# EAGLE design baxandall (EAGLE 7.5.0)
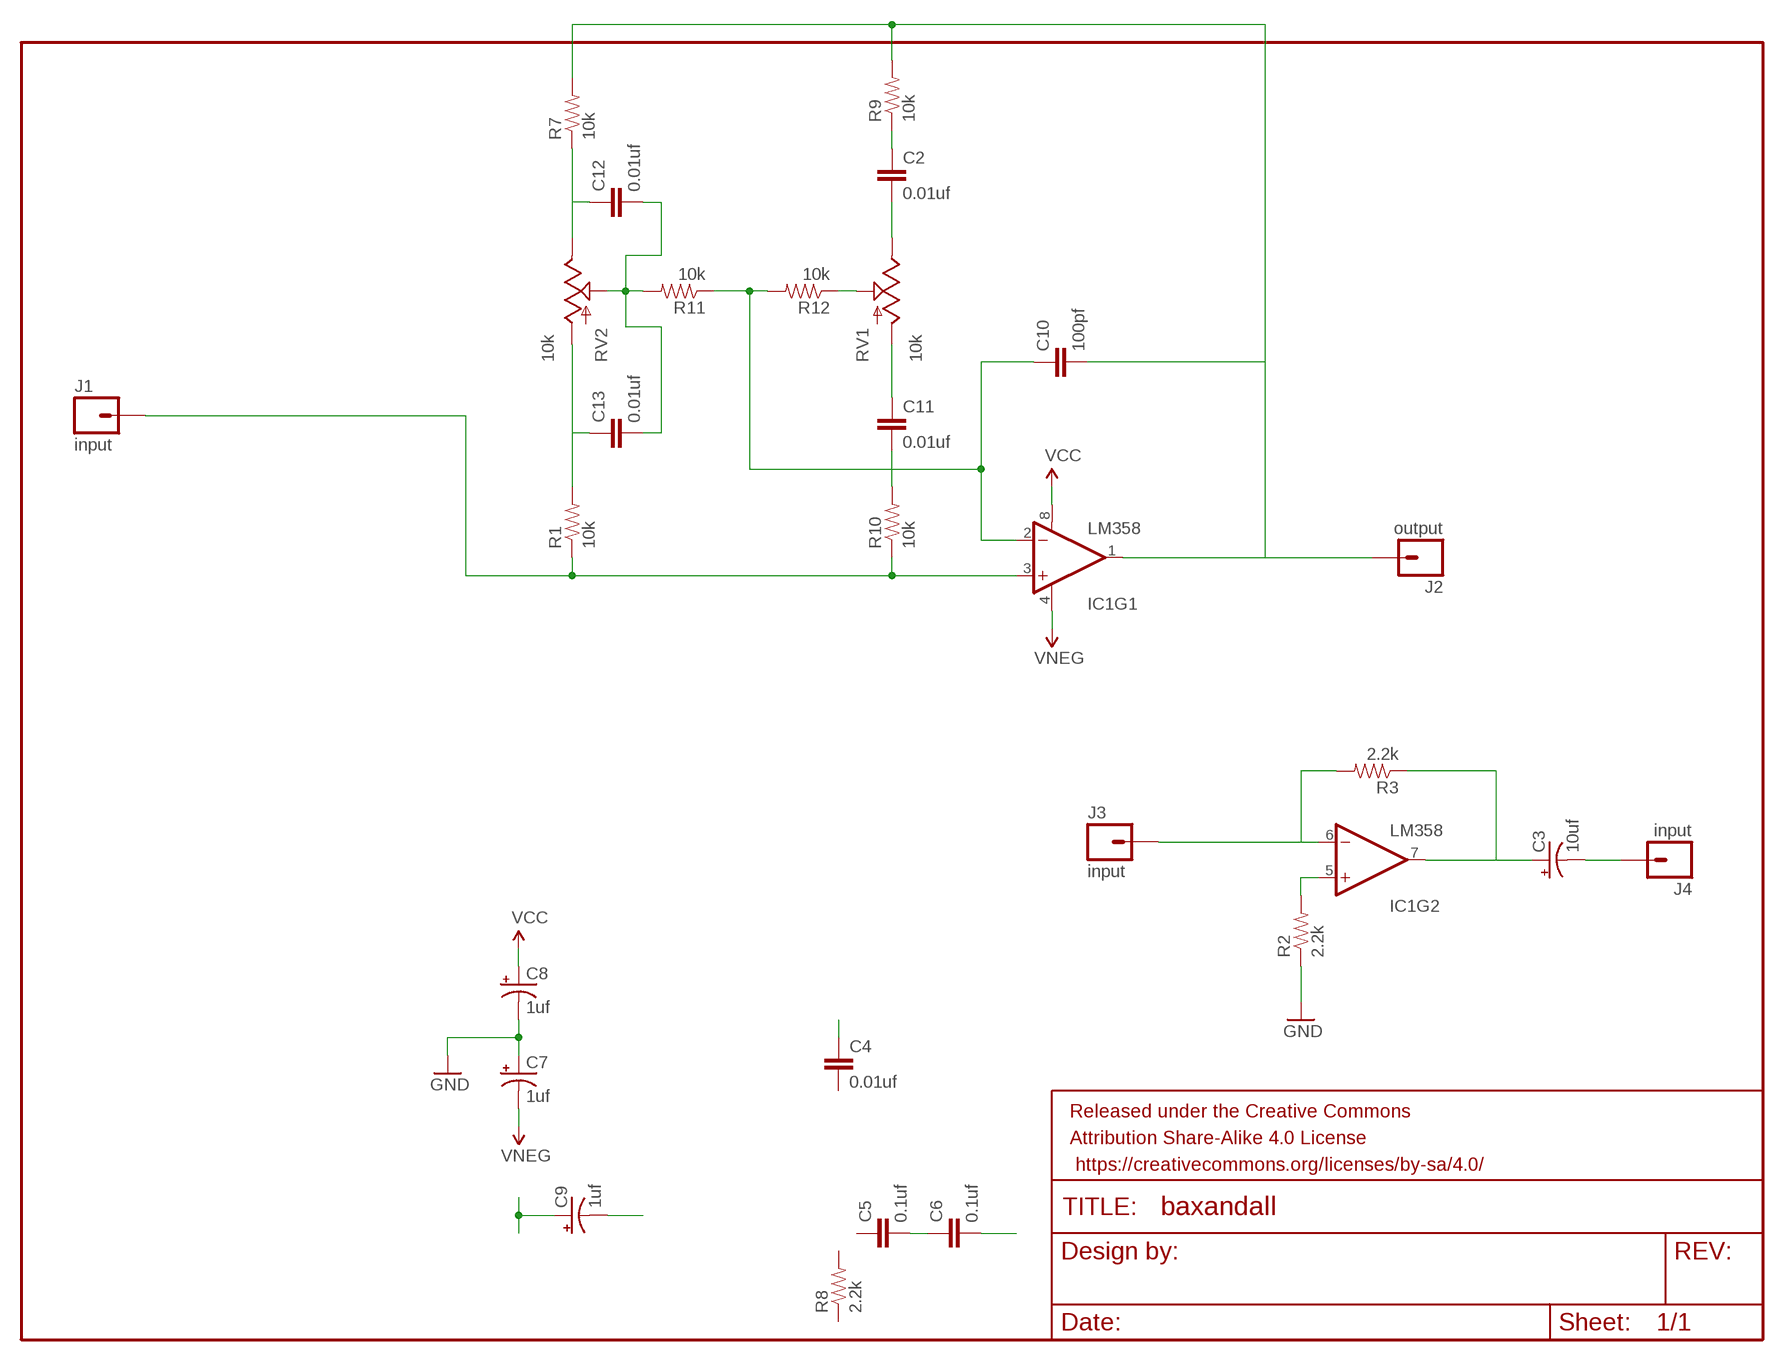
[diagram p0: schematic, sheet 1]

## Parts
C2  0.01uf  CAPPTH  [CAP-PTH-SMALL]
C3  10uf  10UF-25V-20%(PTH)  [CPOL-RADIAL-10UF-25V]
C4  0.01uf  CAPPTH  [CAP-PTH-SMALL]
C5  0.1uf  CAPPTH  [CAP-PTH-SMALL]
C6  0.1uf  CAPPTH  [CAP-PTH-SMALL]
C7  1uf  CAP_POLPTH2  [CPOL-RADIAL-10UF-25V]
C8  1uf  CAP_POLPTH2  [CPOL-RADIAL-10UF-25V]
C9  1uf  CAP_POLPTH2  [CPOL-RADIAL-10UF-25V]
C10  100pf  CAPPTH  [CAP-PTH-SMALL]
C11  0.01uf  CAPPTH  [CAP-PTH-SMALL]
C12  0.01uf  CAPPTH  [CAP-PTH-SMALL]
C13  0.01uf  CAPPTH  [CAP-PTH-SMALL]
FRAME1  FRAME-LETTER  [CREATIVE_COMMONS]
IC1  LM358  [DIP08]
J1  input  M01NOSILK-KIT  [1X01NS-KIT]
J2  output  M01NOSILK-KIT  [1X01NS-KIT]
J3  input  M01NOSILK-KIT  [1X01NS-KIT]
J4  input  M01NOSILK-KIT  [1X01NS-KIT]
R1  10k  10KOHM-1/4W-1%(PTH)HORIZ  [AXIAL-0.3]
R2  2.2k  RESISTORAXIAL-0.3  [AXIAL-0.3]
R3  2.2k  RESISTORAXIAL-0.3  [AXIAL-0.3]
R7  10k  10KOHM-1/4W-1%(PTH)HORIZ  [AXIAL-0.3]
R8  2.2k  RESISTORAXIAL-0.3  [AXIAL-0.3]
R9  10k  10KOHM-1/4W-1%(PTH)HORIZ  [AXIAL-0.3]
R10  10k  10KOHM-1/4W-1%(PTH)HORIZ  [AXIAL-0.3]
R11  10k  10KOHM-1/4W-1%(PTH)HORIZ  [AXIAL-0.3]
R12  10k  10KOHM-1/4W-1%(PTH)HORIZ  [AXIAL-0.3]
RV1  10k  POT-RV16AF-20  [POT_ALPHA_RV16AF-20]
RV2  10k  POT-RV16AF-20  [POT_ALPHA_RV16AF-20]

## Nets
GND: C7.1(+) C8.2(-) R2.P$1
N$1: C12.1 R7.P$1 RV2.3(E)
N$2: C13.1 R1.P$2 RV2.1(A)
N$3: C10.1 IC1.2(-IN) R11.P$1 R12.P$2
N$4: C11.2 R10.P$2
N$5: C10.2 IC1.1(OUT) J2.1 R7.P$2 R9.P$2
N$6: IC1.5(+IN) R2.P$2
N$7: C3.1(+) IC1.7(OUT) R3.P$1
N$8: R12.P$1 RV1.2(S)
N$9: IC1.3(+IN) J1.1 R1.P$1 R10.P$1
N$10: C11.1 RV1.1(A)
N$11: IC1.6(-IN) J3.1 R3.P$2
N$12: C3.2(-) J4.1
N$13: C9.1(+)
N$14: C12.2 C13.2 R11.P$2 RV2.2(S)
N$15: C2.2 RV1.3(E)
N$16: C9.2(-)
N$17: C4.1
N$18: C5.2 C6.1
N$19: C2.1 R9.P$1
N$20: C6.2
VCC: C8.1(+) IC1.8(V+)
VNEG: C7.2(-) IC1.4(V-)
Unconnected: C4.2 C5.1 R8.P$1 R8.P$2

## Library data of the parts
C2 C4-C6 C10-C13 = SparkFun-Capacitors:CAP: Capacitor Standard 0603 ceramic capacitor, and 0.1" leaded capacitor.
C3 = SparkFun-Capacitors:10UF-25V-20%(PTH): CAP-08440; PROD_ID: CAP-08440
C7-C9 = SparkFun-Capacitors:CAP_POL: Capacitor Polarized These are standard SMD and PTH capacitors. Normally 10uF, 47uF, and 100uF in electrolytic and tantalum varieties. Always verify the external diameter of the through hole cap, it varies with capacity, voltage, and manufacturer. The EIA devices should be standard.
FRAME1 = SparkFun-Aesthetics:FRAME-LETTER: Schematic Frame Standard 8.5x11 US Letter frame
IC1 = SparkFun-AnalogIC:LM358: Jellybean op-amp; PROD_ID: IC-09172
J1-J4 = SparkFun-Connectors:M01: Header 1 Standard 1-pin 0.1" header. Use with straight break away headers (SKU : PRT-00116), right angle break away headers (PRT-00553), swiss pins (PRT-00743), machine pins (PRT-00117), and female headers (PRT-00115). SMTSO-256-ET is a "flush mount" nut for a 4-40 screw. The older package used to be too tight, and did not allow it to sit properly thru the drill hit. The latest (0.165DIA) fits nice and snug.
R1 R7 R9-R12 = SparkFun-Resistors:10KOHM-1/4W-1%(PTH): RES-12183; PROD_ID: RES-12183
R2 R3 R8 = SparkFun-Resistors:RESISTOR: Resistor Basic schematic elements and footprints for 0603, 1206, and PTH resistors.
RV1 RV2 = SparkFun-Electromechanical:POT

## Board
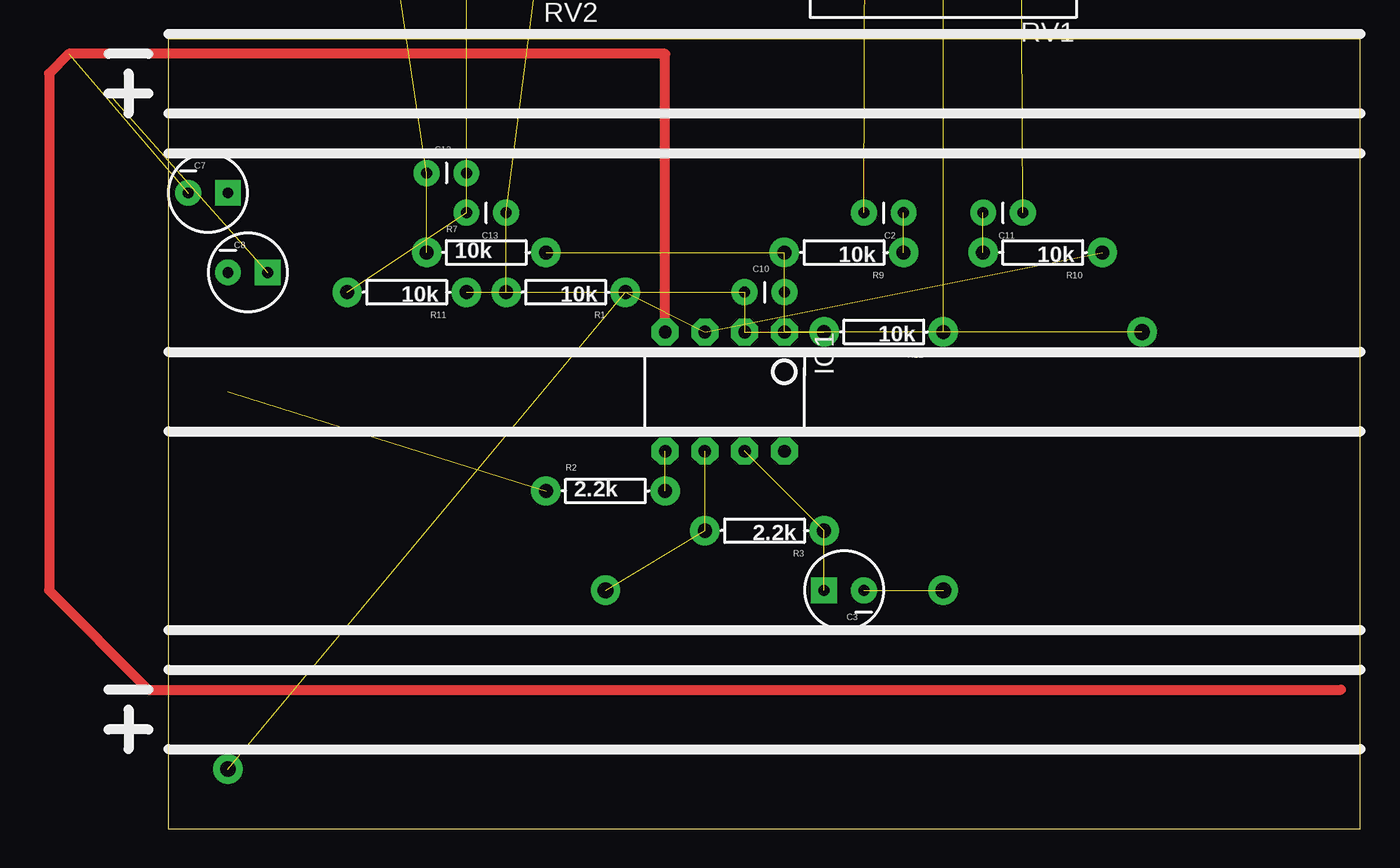
[diagram p1: board, top side]
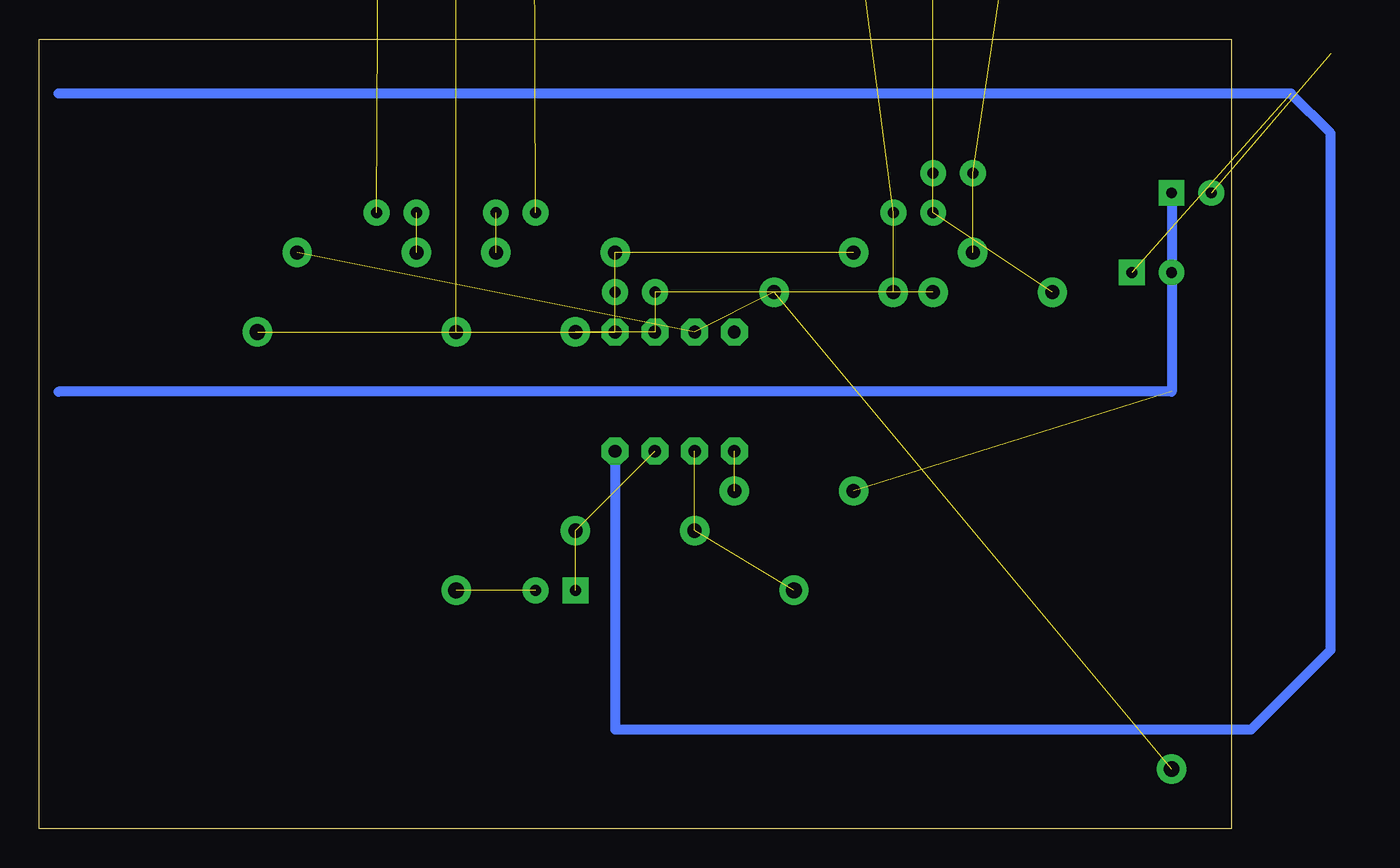
[diagram p2: board, bottom side, seen from below]

Size 76.18 x 50.47 mm. Coordinates in mm from the lower left corner, seen from the top.
Outline: 0,0 76.18,0 76.18,50.47 0,50.47 0,0
Copper layers (1*16): Top 0.035mm / dielectric 1.5mm / Bottom 0.035mm
Design rules "default": minimum track width 10mil, minimum drill 24mil, track to track 8mil, track to pad 8mil, pad to pad 8mil, via to via 8mil, smd to smd 8mil, copper to edge 40mil, drill to drill 8mil, minimum pad ring 10mil, minimum via ring 8mil, stop-mask expansion 4mil, vias tented up to drill 0mil, thermal gap 10mil

### Footprints (pad centres in the part's own frame; a part is rotated, then mirrored left to right if it is on the bottom)
CAP-PTH-SMALL = drill 0.7 pad 1.651: 1 0,0; 2 2.54,0
CPOL-RADIAL-10UF-25V = drill 0.7 pad 1.651 square: 1 1.27,0 | drill 0.7 pad 1.651: 2 -1.27,0
DIP08 = drill 0.813 pad 1.727 octagon: 1 -3.81,-3.81; 2 -1.27,-3.81; 3 1.27,-3.81; 4 3.81,-3.81; 5 3.81,3.81; 6 1.27,3.81; 7 -1.27,3.81; 8 -3.81,3.81
1X01NS-KIT = drill 1.016 pad 1.88: 1 0,0
AXIAL-0.3 = drill 0.9 pad 1.88: P$1 -3.81,0; P$2 3.81,0
POT_ALPHA_RV16AF-20 = drill 1.5 pad 2.54: 1 -5,0; 2 0,0; 3 5,0

### Placement (x,y rotation side)
C2  46.99,39.37 180 top
C3  43.18,15.24 180 top
C4  86.36,17.78 0 top  (outside the outline)
C5  88.9,20.32 180 top  (outside the outline)
C6  88.9,22.86 180 top  (outside the outline)
C7  2.54,40.64 0 top
C8  5.08,35.56 0 top
C9  83.82,39.37 0 top  (outside the outline)
C10  36.83,34.29 0 top
C11  54.61,39.37 180 top
C12  16.51,41.91 0 top
C13  21.59,39.37 180 top
FRAME1  21.59,-7.62 0 top  (outside the outline)
IC1  35.56,27.94 180 top
J1  3.81,3.81 0 top
J2  62.23,31.75 0 top
J3  27.94,15.24 0 top
J4  49.53,15.24 0 top
R1  25.4,34.29 180 top
R2  27.94,21.59 0 top
R3  38.1,19.05 180 top
R7  20.32,36.83 0 top
R8  85.09,30.48 270 top  (outside the outline)
R9  43.18,36.83 180 top
R10  55.88,36.83 180 top
R11  15.24,34.29 180 top
R12  45.72,31.75 180 top
RV1  49.53,57.15 180 top  (outside the outline)
RV2  19.05,58.42 180 top  (outside the outline)

### Tracks (layer width: path | path; a pad name or v marks a point on that pad's centre or on a via)
GND  (1 unrouted)
  Bottom 0.635: C7.1 C8.2 3.81,27.94 74.93,27.94
N$1  (2 unrouted)
N$2  (2 unrouted)
N$3  (3 unrouted)
N$4  (1 unrouted)
N$5  (4 unrouted)
N$6  (1 unrouted)
N$7  (2 unrouted)
N$8  (1 unrouted)
N$9  (3 unrouted)
N$10  (1 unrouted)
N$11  (2 unrouted)
N$12  (1 unrouted)
N$14  (3 unrouted)
N$15  (1 unrouted)
N$18  (1 unrouted)
N$19  (1 unrouted)
VCC  (1 unrouted)
  Bottom 0.635: IC1.8 39.37,6.35 -1.27,6.35 -6.35,11.43 -6.35,44.45 -3.81,46.99 74.93,46.99
VNEG  (1 unrouted)
  Top 0.635: IC1.4 31.75,49.53 -6.35,49.53 -7.62,48.26 -7.62,15.24 -1.27,8.89 74.93,8.89